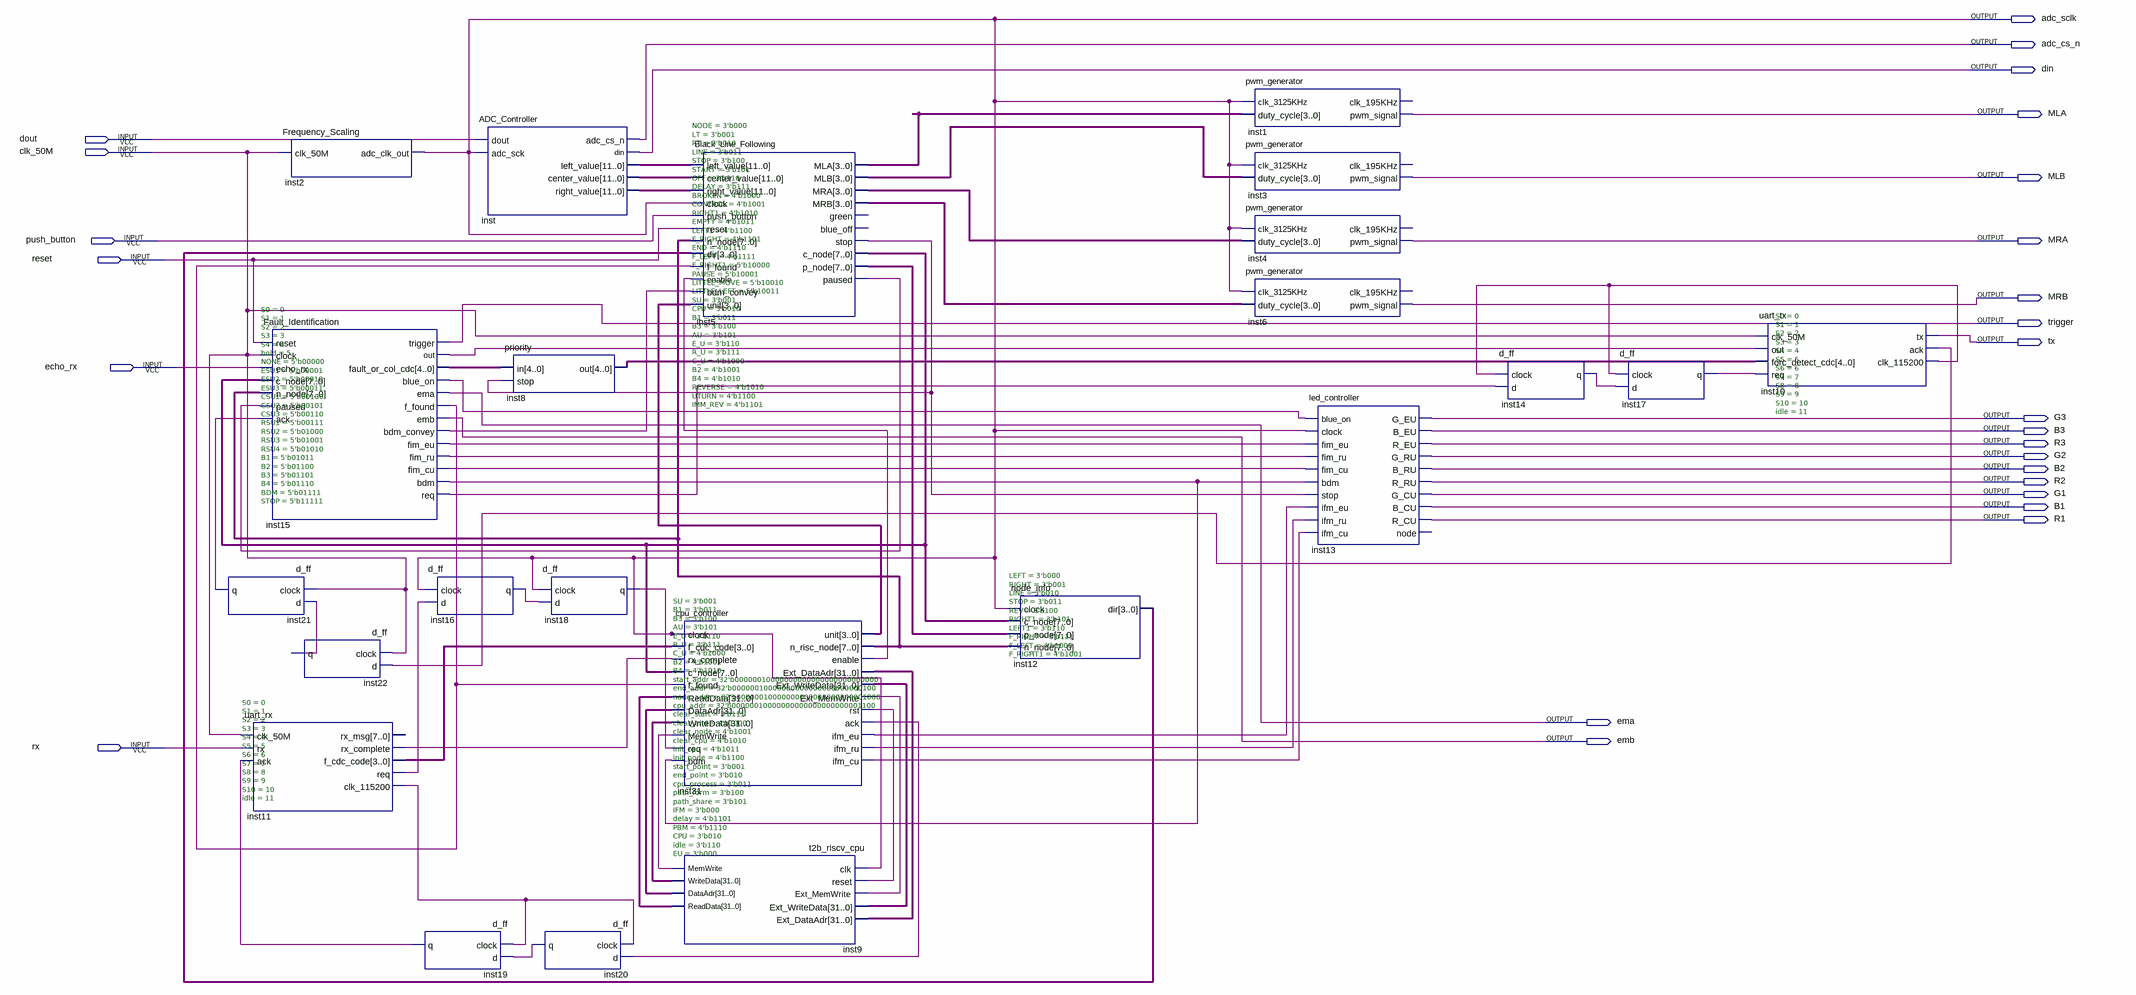
[diagram p0: schematic sheet]
// Quartus schematic AB_LFA_Tester.bdf as structural Verilog: 23 symbols, 26 pins
module AB_LFA_Tester (
  input  dout,
  input  clk_50M,
  input  push_button,
  input  reset,
  input  echo_rx,
  input  rx,
  output adc_sclk,
  output adc_cs_n,
  output din,
  output MLA,
  output MLB,
  output MRA,
  output MRB,
  output trigger,
  output tx,
  output G3,
  output B3,
  output R3,
  output G2,
  output B2,
  output R2,
  output G1,
  output B1,
  output R1,
  output ema,
  output emb
);

  wire inst5_paused, inst5_stop, inst9_memwrite, inst10_ack, inst10_clk_115200, inst11_clk_115200,
       inst11_req, inst11_rx_complete, inst14_q, inst15_bdm, inst15_bdm_convey, inst15_blue_on,
       inst15_f_found, inst15_fim_cu, inst15_fim_eu, inst15_fim_ru, inst15_out, inst15_req, inst16_q,
       inst17_q, inst18_q, inst19_q, inst20_q, inst21_q, inst22_q, inst31_ack, inst31_enable,
       inst31_ext_memwrite, inst31_ifm_cu, inst31_ifm_eu, inst31_ifm_ru, inst31_rst;
  wire [3:0] inst5_mla, inst5_mlb, inst5_mra, inst5_mrb, inst11_f_cdc_code, inst12_dir, inst31_unit;
  wire [4:0] inst8_out, inst15_fault_or_col_cdc;
  wire [7:0] inst5_c_node, inst5_p_node, inst31_n_risc_node;
  wire [11:0] inst_center_value, inst_left_value, inst_right_value;
  wire [31:0] inst9_dataadr, inst9_readdata, inst9_writedata, inst31_ext_dataadr, inst31_ext_writedata;

  d_ff inst21 (.clock(clk_50M), .d(inst22_q), .q(inst21_q));
  Fault_Identification #(.S0(0), .S1(1), .S2(2), .S3(3), .S4(4), .hold(5), .NONE(5'b00000), .ESU1(5'b00001), .ESU2(5'b00010), .ESU3(5'b00011), .CSU1(5'b00100), .CSU2(5'b00101), .CSU3(5'b00110), .RSU1(5'b00111), .RSU2(5'b01000), .RSU3(5'b01001), .RSU4(5'b01010), .B1(5'b01011), .B2(5'b01100), .B3(5'b01101), .B4(5'b01110), .BDM(5'b01111), .STOP(5'b11111)) inst15 (
    .reset(reset), .clock(clk_50M), .echo_rx(echo_rx), .c_node(inst5_c_node), .n_node(inst31_n_risc_node),
    .paused(inst5_paused), .ack(inst21_q), .trigger(trigger), .out(inst15_out),
    .fault_or_col_cdc(inst15_fault_or_col_cdc), .blue_on(inst15_blue_on), .ema(ema),
    .f_found(inst15_f_found), .emb(emb), .bdm_convey(inst15_bdm_convey), .fim_eu(inst15_fim_eu),
    .fim_ru(inst15_fim_ru), .fim_cu(inst15_fim_cu), .bdm(inst15_bdm), .req(inst15_req));
  uart_rx #(.S0(0), .S1(1), .S2(2), .S3(3), .S4(4), .S5(5), .S6(6), .S7(7), .S8(8), .S9(9), .S10(10), .idle(11)) inst11 (
    .clk_50M(clk_50M), .rx(rx), .ack(inst19_q), .rx_complete(inst11_rx_complete),
    .f_cdc_code(inst11_f_cdc_code), .req(inst11_req), .clk_115200(inst11_clk_115200));  // open: rx_msg
  Frequency_Scaling inst2 (.clk_50M(clk_50M), .adc_clk_out(adc_sclk));
  d_ff inst22 (.clock(clk_50M), .d(inst10_ack), .q(inst22_q));
  d_ff inst19 (.clock(inst11_clk_115200), .d(inst20_q), .q(inst19_q));
  d_ff inst16 (.clock(adc_sclk), .d(inst11_req), .q(inst16_q));
  ADC_Controller inst (
    .dout(dout), .adc_sck(adc_sclk), .adc_cs_n(adc_cs_n), .din(din), .left_value(inst_left_value),
    .center_value(inst_center_value), .right_value(inst_right_value));
  \priority  inst8 (.in(inst15_fault_or_col_cdc), .stop(inst5_stop), .out(inst8_out));
  d_ff inst18 (.clock(adc_sclk), .d(inst16_q), .q(inst18_q));
  d_ff inst20 (.clock(inst11_clk_115200), .d(inst31_ack), .q(inst20_q));
  cpu_controller #(.SU(3'b001), .B1(3'b011), .B3(3'b100), .AU(3'b101), .E_U(3'b110), .R_U(3'b111), .C_U(4'b1000), .B2(4'b1001), .B4(4'b1010), .start_addr(32'b00000010000000000000000000000000), .end_addr(32'b00000010000000000000000000000100), .node_addr(32'b00000010000000000000000000001000), .cpu_addr(32'b00000010000000000000000000001100), .clear_start(3'b111), .clear_end(4'b1000), .clear_node(4'b1001), .clear_cpu(4'b1010), .init_cpu(4'b1011), .init_node(4'b1100), .start_point(3'b001), .end_point(3'b010), .cpu_process(3'b011), .path_form(3'b100), .path_share(3'b101), .IFM(3'b000), .delay(4'b1101), .PBM(4'b1110), .CPU(3'b010), .idle(3'b110), .EU(3'b000)) inst31 (
    .clock(adc_sclk), .f_cdc_code(inst11_f_cdc_code), .rx_complete(inst11_rx_complete),
    .c_node(inst5_c_node), .f_found(inst15_f_found), .ReadData(inst9_readdata), .DataAdr(inst9_dataadr),
    .WriteData(inst9_writedata), .MemWrite(inst9_memwrite), .req(inst18_q), .bdm(inst15_bdm),
    .unit(inst31_unit), .n_risc_node(inst31_n_risc_node), .enable(inst31_enable),
    .Ext_DataAdr(inst31_ext_dataadr), .Ext_WriteData(inst31_ext_writedata),
    .Ext_MemWrite(inst31_ext_memwrite), .rst(inst31_rst), .ack(inst31_ack), .ifm_eu(inst31_ifm_eu),
    .ifm_ru(inst31_ifm_ru), .ifm_cu(inst31_ifm_cu));
  t2b_riscv_cpu inst9 (
    .clk(adc_sclk), .reset(inst31_rst), .Ext_MemWrite(inst31_ext_memwrite),
    .Ext_WriteData(inst31_ext_writedata), .Ext_DataAdr(inst31_ext_dataadr), .MemWrite(inst9_memwrite),
    .WriteData(inst9_writedata), .DataAdr(inst9_dataadr), .ReadData(inst9_readdata));
  Black_Line_Following #(.NODE(3'b000), .LT(3'b001), .RT(3'b010), .LINE(3'b011), .STOP(3'b100), .START(3'b101), .OFF(3'b110), .DELAY(3'b111), .BROKEN(4'b1000), .CONTROL(4'b1001), .RIGHT1(4'b1010), .EMPTY(4'b1011), .LEFT1(4'b1100), .F_RIGHT(4'b1101), .END(4'b1110), .F_LEFT(4'b1111), .F_RIGHT1(5'b10000), .PAUSE(5'b10001), .LITTLE_MOVE(5'b10010), .LITTLE_LEFT(5'b10011), .SU(3'b001), .CPU(3'b010), .B1(3'b011), .B3(3'b100), .AU(3'b101), .E_U(3'b110), .R_U(3'b111), .C_U(4'b1000), .B2(4'b1001), .B4(4'b1010), .REVERSE(4'b1010), .UTURN(4'b1100), .IMM_REV(4'b1101)) inst5 (
    .left_value(inst_left_value), .center_value(inst_center_value), .right_value(inst_right_value),
    .clock(adc_sclk), .push_button(push_button), .reset(reset), .n_node(inst31_n_risc_node),
    .dir(inst12_dir), .f_found(inst15_f_found), .enable(inst31_enable), .bdm_convey(inst15_bdm_convey),
    .unit(inst31_unit), .MLA(inst5_mla), .MLB(inst5_mlb), .MRA(inst5_mra), .MRB(inst5_mrb),
    .stop(inst5_stop), .c_node(inst5_c_node), .p_node(inst5_p_node), .paused(inst5_paused));  // open: green, blue_off
  node_info #(.LEFT(3'b000), .RIGHT(3'b001), .LINE(3'b010), .STOP(3'b011), .REV(3'b100), .RIGHT1(3'b101), .LEFT1(3'b110), .F_RIGHT(3'b111), .F_LEFT(4'b1000), .F_RIGHT1(4'b1001)) inst12 (
    .clock(adc_sclk), .c_node(inst5_c_node), .p_node(inst5_p_node), .n_node(inst31_n_risc_node),
    .dir(inst12_dir));
  pwm_generator inst1 (.clk_3125KHz(adc_sclk), .duty_cycle(inst5_mla), .pwm_signal(MLA));  // open: clk_195KHz
  pwm_generator inst3 (.clk_3125KHz(adc_sclk), .duty_cycle(inst5_mlb), .pwm_signal(MLB));  // open: clk_195KHz
  pwm_generator inst4 (.clk_3125KHz(adc_sclk), .duty_cycle(inst5_mra), .pwm_signal(MRA));  // open: clk_195KHz
  pwm_generator inst6 (.clk_3125KHz(adc_sclk), .duty_cycle(inst5_mrb), .pwm_signal(MRB));  // open: clk_195KHz
  led_controller inst13 (
    .blue_on(inst15_blue_on), .clock(adc_sclk), .fim_eu(inst15_fim_eu), .fim_ru(inst15_fim_ru),
    .fim_cu(inst15_fim_cu), .bdm(inst15_bdm), .stop(inst5_stop), .ifm_eu(inst31_ifm_eu),
    .ifm_ru(inst31_ifm_ru), .ifm_cu(inst31_ifm_cu), .G_EU(G3), .B_EU(B3), .R_EU(R3), .G_RU(G2), .B_RU(B2),
    .R_RU(R2), .G_CU(G1), .B_CU(B1), .R_CU(R1));  // open: node
  d_ff inst14 (.clock(inst10_clk_115200), .d(inst15_req), .q(inst14_q));
  d_ff inst17 (.clock(inst10_clk_115200), .d(inst14_q), .q(inst17_q));
  uart_tx #(.S0(0), .S1(1), .S2(2), .S3(3), .S4(4), .S5(5), .S6(6), .S7(7), .S8(8), .S9(9), .S10(10), .idle(11)) inst10 (
    .clk_50M(clk_50M), .out(inst15_out), .forc_detect_cdc(inst8_out), .req(inst17_q), .tx(tx),
    .ack(inst10_ack), .clk_115200(inst10_clk_115200));
endmodule
